# Altium schematic sheet MCU.SchDoc
size A4; SheetNumber: 1; SheetTotal: 3
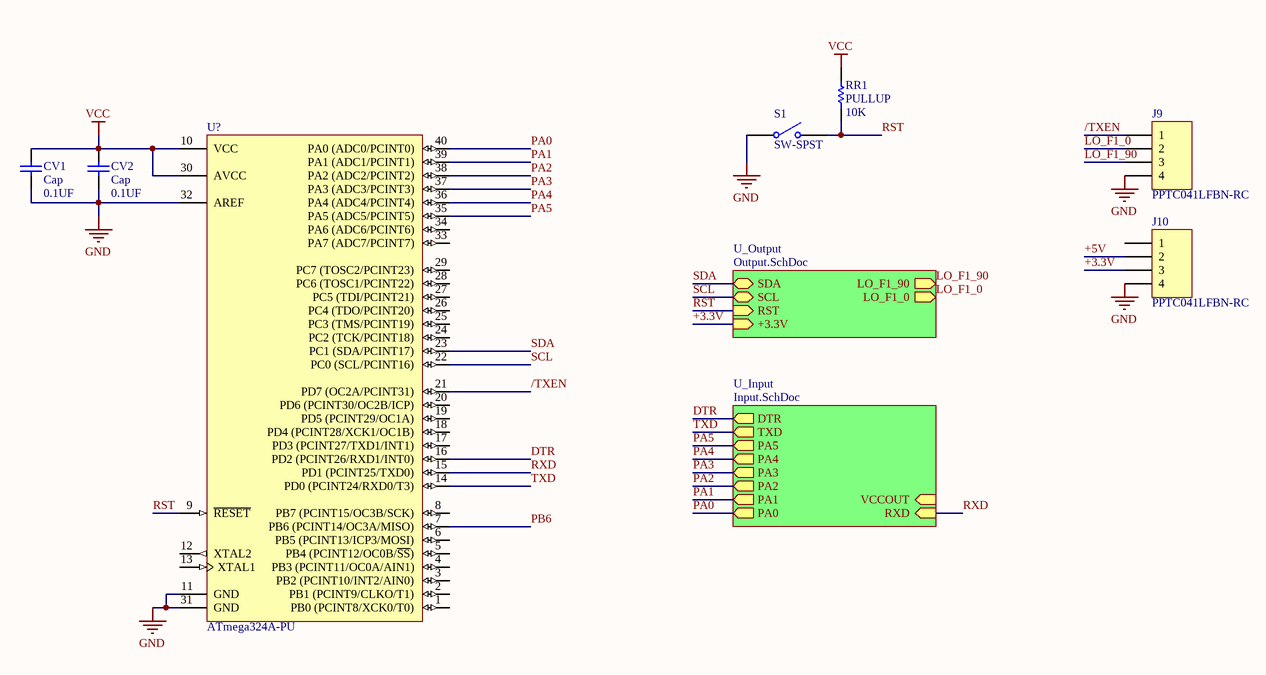
[diagram p0: MCU.SchDoc]

## Parts
CV1  Cap  value 0.1UF  [1206]
CV2  Cap  value 0.1UF  [1206]
J9  PPTC041LFBN-RC  [HDR1X4]
J10  PPTC041LFBN-RC  [HDR1X4]
RR1  PULLUP  value 10K  [AXIAL-0.1-RES]
S1  SW-SPST  [SPST-2]
U?  ATmega324A-PU  [40P6]

## Sub-sheets
U_Input = Input.SchDoc: PA0 (out), PA1 (out), PA2 (out), PA3 (out), PA4 (out), PA5 (out), TXD (out), RXD (in), VCCOUT (in), DTR (out)
U_Output = Output.SchDoc: SDA (bidir), SCL (bidir), LO_F1_90 (out), LO_F1_0 (out), RST (in), +3.3V (in)

## Nets
GND: CV1.1 CV2.1 J9.4 J10.4 S1.1(COMMON) U?.11(GND) U?.31(GND) U?.32(AREF)
VCC: CV1.2 CV2.2 RR1.2 U?.10(VCC) U?.30(AVCC)
+3.3V: J10.3 ; sheet U_Output/+3.3V
+5V: J10.2
/TXEN: J9.1 U?.21(PD7_(OC2A/PCINT31))
DTR: U?.16(PD2_(PCINT26/RXD1/INT0)) ; sheet U_Input/DTR
LO_F1_0: J9.2 ; sheet U_Output/LO_F1_0
LO_F1_90: J9.3 ; sheet U_Output/LO_F1_90
PA0: U?.40(PA0_(ADC0/PCINT0)) ; sheet U_Input/PA0
PA1: U?.39(PA1_(ADC1/PCINT1)) ; sheet U_Input/PA1
PA2: U?.38(PA2_(ADC2/PCINT2)) ; sheet U_Input/PA2
PA3: U?.37(PA3_(ADC3/PCINT3)) ; sheet U_Input/PA3
PA4: U?.36(PA4_(ADC4/PCINT4)) ; sheet U_Input/PA4
PA5: U?.35(PA5_(ADC5/PCINT5)) ; sheet U_Input/PA5
PB6: U?.7(PB6_(PCINT14/OC3A/MISO))
RST: RR1.1 S1.2(NO) U?.9(~{RESET}) ; sheet U_Output/RST
RXD: U?.15(PD1_(PCINT25/TXD0)) ; sheet U_Input/RXD
SCL: U?.22(PC0_(SCL/PCINT16)) ; sheet U_Output/SCL
SDA: U?.23(PC1_(SDA/PCINT17)) ; sheet U_Output/SDA
TXD: U?.14(PD0_(PCINT24/RXD0/T3)) ; sheet U_Input/TXD

Not connected (* = marked no-connect by the designer): J10 1; U? 1(PB0_(PCINT8/XCK0/T0)) 2(PB1_(PCINT9/CLKO/T1)) 3(PB2_(PCINT10/INT2/AIN0)) 4(PB3_(PCINT11/OC0A/AIN1)) 5(PB4_(PCINT12/OC0B/~{SS})) 6(PB5_(PCINT13/ICP3/MOSI)) 8(PB7_(PCINT15/OC3B/SCK)) 12(XTAL2) 13(XTAL1) 17(PD3_(PCINT27/TXD1/INT1)) 18(PD4_(PCINT28/XCK1/OC1B)) 19(PD5_(PCINT29/OC1A)) 20(PD6_(PCINT30/OC2B/ICP)) 24(PC2_(TCK/PCINT18)) 25(PC3_(TMS/PCINT19)) 26(PC4_(TDO/PCINT20)) 27(PC5_(TDI/PCINT21)) 28(PC6_(TOSC1/PCINT22)) 29(PC7_(TOSC2/PCINT23)) 33(PA7_(ADC7/PCINT7)) 34(PA6_(ADC6/PCINT6))

## Library data of the parts
CV1 CV2 = CAP CER 0.1UF 50V X7R 1206: Capacitor; Manufacturer Part Number: 885012208087; Designator: C?; Voltage Rating: 50V; Published: 8-Jun-2000; LatestRevisionDate: 17-Jul-2002; LatestRevisionNote: Re-released for DXP Platform.; Publisher: Altium Limited
J9 J10 = Header 4: Header, 4-Pin; LatestRevisionDate: 17-Jul-2002; LatestRevisionNote: Re-released for DXP Platform.; Publisher: Altium Limited
RR1 = RES 10K OHM 5% 1/4W AXIAL: Resistor; Manufacturer Part Number: CFR-25JB-52-10K; Designator: R?; Power Rating: 1/4W; Tolerance: 0.05; Published: 8-Jun-2000; LatestRevisionDate: 17-Jul-2002; LatestRevisionNote: Re-released for DXP Platform.; Publisher: Altium Limited
S1 = SW-SPST: Single-Pole, Single-Throw Switch; Published: 24-Mar-1999; LatestRevisionDate: 17-Jul-2002; LatestRevisionNote: Re-released for DXP Platform.; PackageReference: SPST-2; Publisher: Altium Limited; PackageDescription: Switch; 2 Leads
U? = CMP-0095-00016-2: 8-bit AVR Microcontroller, 32KB Flash, 1KB EEPROM, 2KB SRAM, 40-pin PDIP, Industrial Grade (-40°C to 85°C); ComponentLink2URL: http://www.atmel.com/dyn/resources/prod_documents/doc8272.pdf; RevisionNote: DatasheetVersion & Sch pin names updated. URLs added.; PackageReference: 40P6; PackageDescription: 40-lead (0.600"/15.24mm Wide) Plastic Dual Inline Package (PDIP); ComponentLink3Description: ATmega164A/164PA/324A/324PA/644A/644PA/1284/1284P Summary; ComponentLink3URL: http://www.atmel.com/dyn/resources/prod_documents/8272S.pdf; Code_JEDEC: MS-011-AC; ComponentLink1URL: http://www.atmel.com/; PackageVersion: revB, Sep-2001; DatasheetVersion: revC, Jun-2011; ComponentLink2Description: ATmega164A/164PA/324A/324PA/644A/644PA/1284/1284P Datasheet; ComponentLink1Description: Manufacturer URL